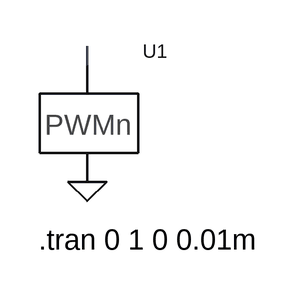
[diagram p0: schematic PWMntest.asc]
PWMntest.asc, the LTspice schematic file:
Version 4
SHEET 1 880 680
WIRE 176 112 176 96
FLAG 176 208 0
SYMBOL PWMn 176 160 R0
SYMATTR InstName U1
TEXT 136 256 Left 0 !.tran 0 1 0 0.01m

The netlist it stands for:
* PWMntest.asc
XU1 N001 0 PWM  ; pins P N
.tran 0 1 0 0.01m
.lib PWM.sub
.backanno
.end